# Altium schematic sheet DRIVER.SchDoc: MAGNETORQUER
size A; Author: Seth Ferrell; CompanyName: Bruin Space; SheetNumber: 2; SheetTotal: 4
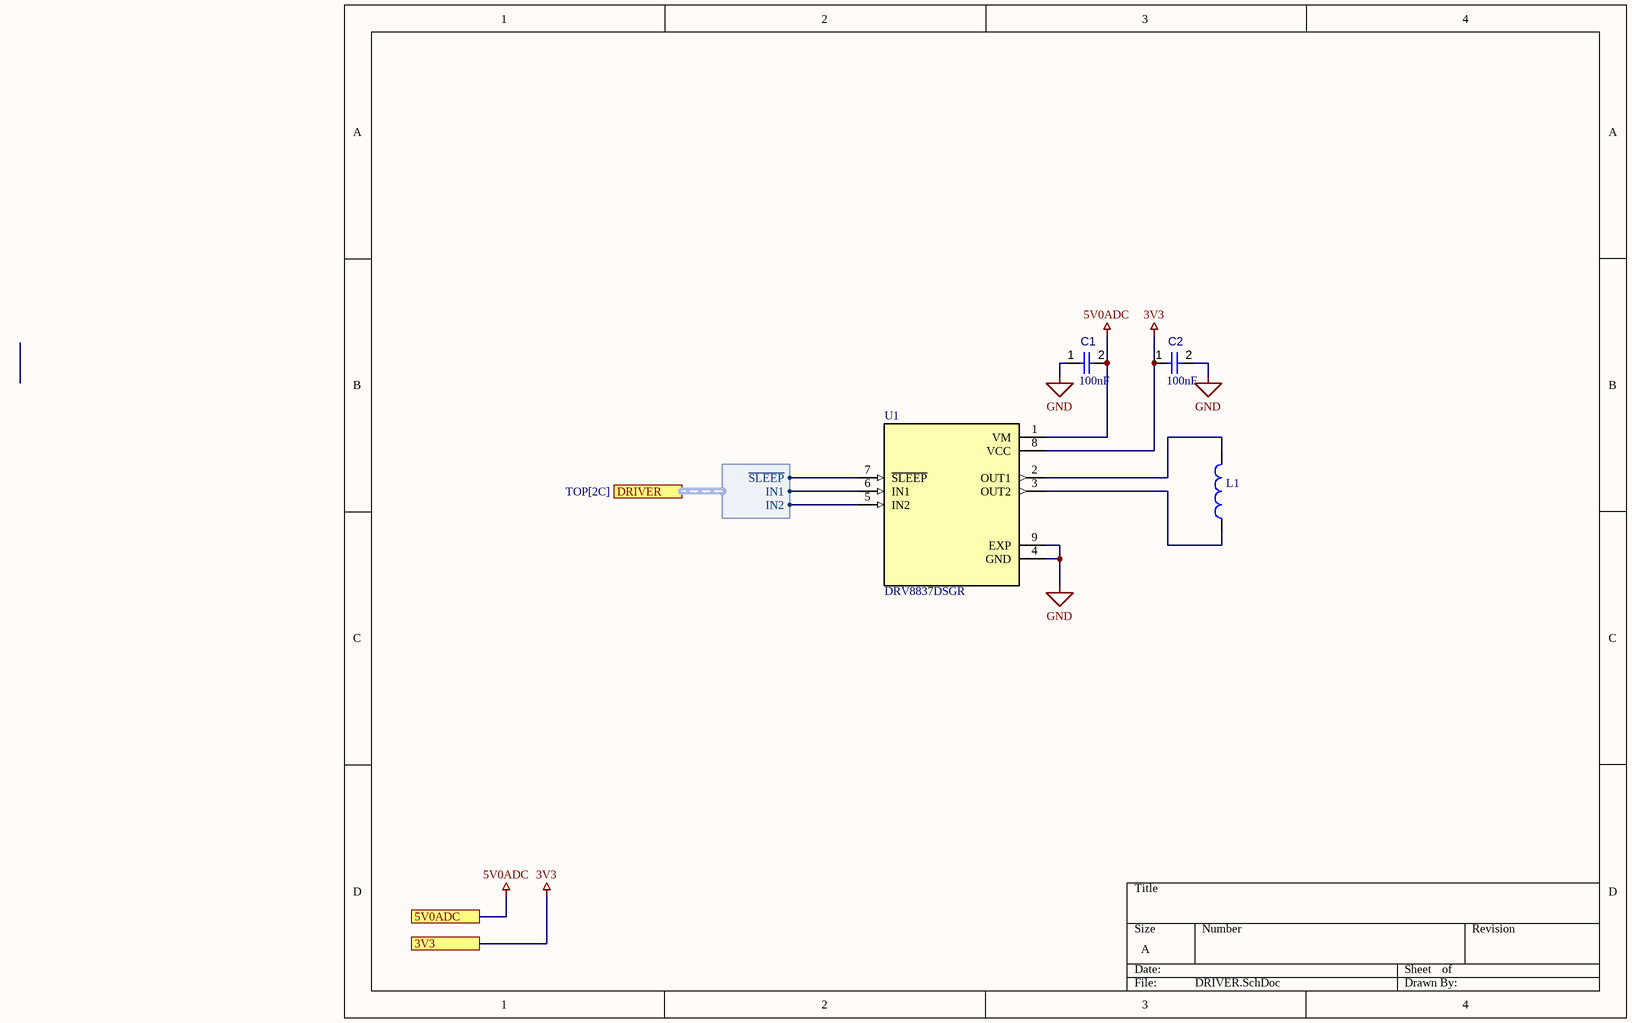
[diagram p0: DRIVER.SchDoc]

## Parts
C1  value 100nF  [CAPC1005X56X25LL10T15]  (hidden comment: Capacitor 0.1 uF +/- 5% 16 V 0402)
C2  value 100nF  [CAPC1005X56X25LL10T15]  (hidden comment: Capacitor 0.1 uF +/- 5% 16 V 0402)
L1  Inductors  (value not drawn)
U1  DRV8837DSGR  [SON50P200X200X80-9N]

## Ports
3V3, 5V0ADC, DRIVER (harness DRIVER, see TOP[2C])

## Harnesses
DRIVER: ~{SLEEP}, IN1, IN2

## Nets
3V3: C2.1 U1.8(VCC) ; port 3V3
5V0ADC: C1.2 U1.1(VM) ; port 5V0ADC
GND: C1.1 C2.2 U1.4(GND) U1.9(EXP)
NetL1_1: L1.1 U1.3(OUT2)
NetL1_2: L1.2 U1.2(OUT1)
NetU1_5: U1.5(IN2) ; port DRIVER.IN2
NetU1_6: U1.6(IN1) ; port DRIVER.IN1
NetU1_7: U1.7(~{SLEEP}) ; port DRIVER.~{SLEEP}

## Library data of the parts
C1 C2 = CMP-001-00001-6: Chip Capacitor, 0.1 uF, +/- 5%, 16 V, 0402 (1005 Metric); Capacitor Type: Ceramic; Voltage Rating: 16V; Max Operating Temperature: 125°C; Min Operating Temperature: -55°C; Case/Package: 0402; Mounting Technology: SM; Pins: 2; Tolerance: 5%; RoHS Compliant: True
U1 = CMP-002-000000-2: 11-V, 1.8-A H-bridge motor driver 8-WSON -40 to 85; MF: Texas Instruments; SnapEDA_Link: https://www.snapeda.com/parts/DRV8837DSGR/Texas%20Instruments/view-part/230051/?ref=snap; Component Type: Standard; BuyPart: https://www.snapeda.com/parts/DRV8837DSGR/Texas%20Instruments/view-part/230051/?ref=eda; Pin Count: 9; Source: DRV8837DSGR.SchLib; Arrow_Electronics-Purchase-URL: https://snapeda.com/shop?store=Arrow+Electronics&id=230051; Texas_Instruments-Purchase-URL: https://snapeda.com/shop?store=Texas+Instruments&id=230051; Design Item ID: DRV8837DSGR; DigiKey-Purchase-URL: https://snapeda.com/shop?store=DigiKey&id=230051; Value: *; MP: DRV8837DSGR; Package: WSON-8 Texas Instruments; Mouser-Purchase-URL: https://snapeda.com/shop?store=Mouser&id=230051; Digi-Key_Part_Number: 296-34806-1-ND
L1 = Inductors: Component Type: Inductors